# EAGLE design Slave (EAGLE 9.3.0)
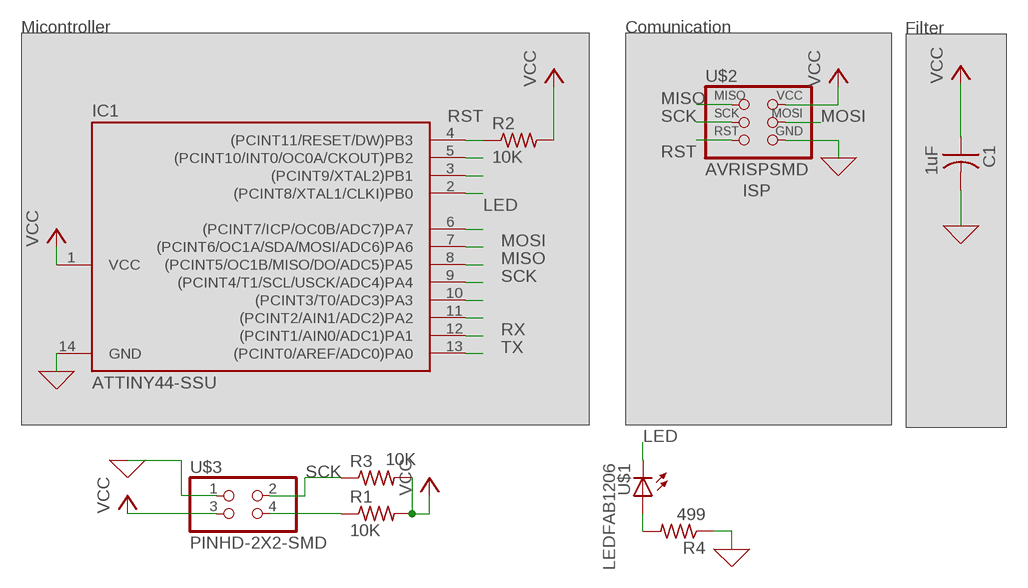
[diagram p0: schematic, sheet 1]

## Parts
C1  1uF  CAP-US1206FAB  [C1206FAB]
IC1  ATTINY44-SSU  [SOIC14]
R1  10K  RES-US1206FAB  [R1206FAB]
R2  10K  RES-US1206FAB  [R1206FAB]
R3  10K  RES-US1206FAB  [R1206FAB]
R4  499  RES-US1206FAB  [R1206FAB]
U$1  LEDFAB1206  [LED1206FAB]
U$2  AVRISPSMD  [2X03SMD]
U$3  PINHD-2X2-SMD  [2X02SMD]

## Nets
0: C1.2 IC1.14(GND) R4.1 U$2.6(GND) U$3.1 ; supply symbol labelled GND
LED: IC1.6((PCINT7/ICP/OC0B/ADC7)PA7) U$1.2(C)
MISO: IC1.8((PCINT5/OC1B/MISO/DO/ADC5)PA5) U$2.1(MISO)
MOSI: IC1.7((PCINT6/OC1A/SDA/MOSI/ADC6)PA6) R1.1 U$2.4(MOSI) U$3.4
N$1: R4.2 U$1.1(A)
N$5: IC1.5((PCINT10/INT0/OC0A/CKOUT)PB2)
N$6: IC1.3((PCINT9/XTAL2)PB1)
N$7: IC1.2((PCINT8/XTAL1/CLKI)PB0)
N$12: IC1.10((PCINT3/T0/ADC3)PA3)
N$13: IC1.11((PCINT2/AIN1/ADC2)PA2)
RST: IC1.4((PCINT11/RESET/DW)PB3) R2.1 U$2.5(RST)
RX: IC1.12((PCINT1/AIN0/ADC1)PA1)
SCK: IC1.9((PCINT4/T1/SCL/USCK/ADC4)PA4) R3.1 U$2.3(SCK) U$3.2
TX: IC1.13((PCINT0/AREF/ADC0)PA0)
VCC: C1.1 IC1.1(VCC) R1.2 R2.2 R3.2 U$2.2(VCC) U$3.3

## Notes on the sheet
- Micontroller | Comunication | Filter
- ISP

## Library data of the parts
C1 = fab:CAP-US
IC1 = fab:ATTINY44
R1-R4 = fab:RES-US: Resistor (US Symbol) Variants with postfix FAB are widened to allow the routing of internal traces
U$1 = fab:LED: LED
U$2 = fab:AVRISP
U$3 = fab:PINHD-2X2-SMD

## Board
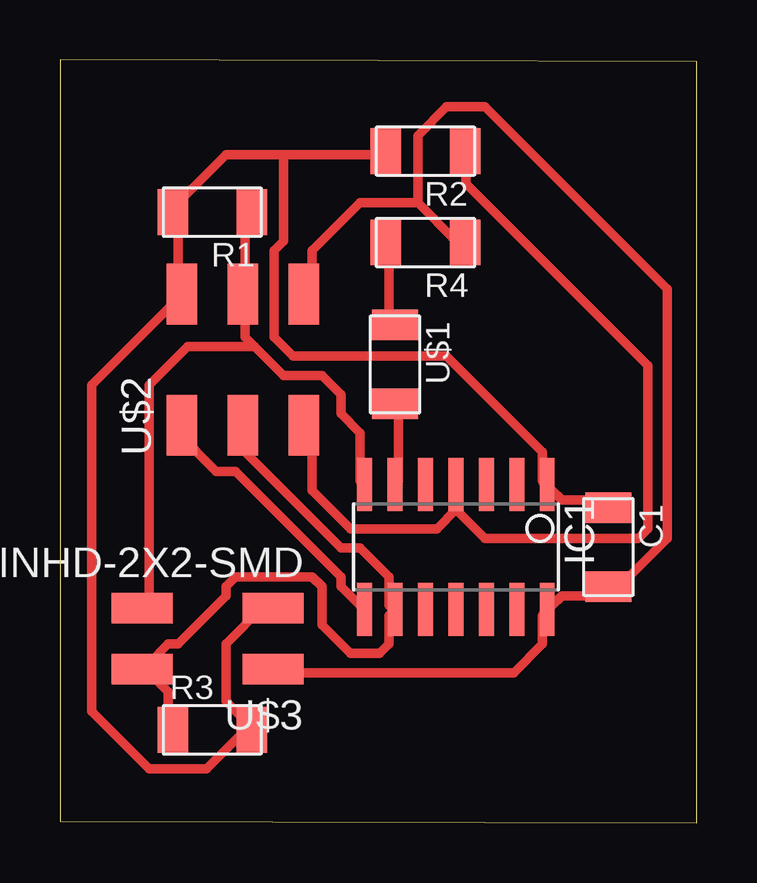
[diagram p1: board, top side]

Size 26.54 x 31.8 mm. Coordinates in mm from the lower left corner, seen from the top.
Outline: 0,0.06 26.54,0 26.54,31.74 0,31.8 0,0.06
Copper layers (1*16): Top 0.035mm / dielectric 1.5mm / Bottom 0.035mm
Design rules "default *": minimum track width 0.4mm, minimum drill 0.35mm, track to track 0.4mm, track to pad 0.4mm, pad to pad 0.4mm, via to via 0.4mm, smd to smd 0.4mm, copper to edge 40mil, drill to drill 6mil, minimum pad ring 10mil, minimum via ring 8mil, stop-mask expansion 4mil, vias tented up to drill 0mil, thermal gap 10mil

### Footprints (pad centres in the part's own frame; a part is rotated, then mirrored left to right if it is on the bottom)
C1206FAB = smd 1.27 x 1.905: 1 -1.651,0; 2 1.651,0
SOIC14 = smd 0.61 x 2.21: 1 -3.81,-2.603; 2 -2.54,-2.603; 3 -1.27,-2.603; 4 0,-2.603; 5 1.27,-2.603; 6 2.54,-2.603; 7 3.81,-2.603; 8 3.81,2.603; 9 2.54,2.603; 10 1.27,2.603; 11 0,2.603; 12 -1.27,2.603; 13 -2.54,2.603; 14 -3.81,2.603
R1206FAB = smd 1.27 x 1.905: 1 -1.651,0; 2 1.651,0
LED1206FAB = smd 1.27 x 1.905: 1 -1.651,0; 2 1.651,0
2X03SMD = smd 2.54 x 1.27: 1 -2.54,2.54; 2 2.92,2.54; 3 -2.54,0; 4 2.92,0; 5 -2.54,-2.54; 6 2.92,-2.54
2X02SMD = smd 2.54 x 1.27: 1 -2.54,1.27; 2 2.92,1.27; 3 -2.54,-1.27; 4 2.92,-1.27

### Placement (x,y rotation side)
C1  22.86,11.49 270 top
IC1  16.51,11.49 180 top
R1  6.35,25.46 180 top
R2  15.24,28 180 top
R3  6.35,3.87 0 top
R4  15.24,24.19 180 top
U$1  13.97,19.11 270 top
U$2  7.62,19.11 90 top
U$3  6.35,7.68 180 top

### Tracks (layer width: path | path; a pad name or v marks a point on that pad's centre or on a via)
0
  Top 0.4: 14.92,25.85 16.52,24.25 R4.1 | 14.92,25.85 12.52,25.85 10.52,23.85 10.52,22.25 U$2.6 | U$3.1 8.92,6.25 18.92,6.25 20.12,7.45 20.12,8.65 IC1.14 20.52,9.05 20.92,9.45 22.52,9.45 C1.2 22.92,9.45 25.32,11.85 25.32,22.25 17.72,29.85 16.12,29.85 14.92,28.65 14.92,25.85
LED
  Top 0.4: U$1.2 14.12,17.45 14.12,14.25 IC1.6
MISO
  Top 0.4: IC1.8 12.52,9.05 11.72,9.85 11.72,10.25 7.32,14.65 6.52,14.65 4.92,16.25 U$2.1
MOSI
  Top 0.4: R1.1 7.72,25.45 7.72,22.25 U$2.4 7.72,21.85 7.72,20.25 8.12,19.85 | 8.12,19.85 9.32,18.65 10.92,18.65 11.72,17.85 11.72,17.05 12.52,16.25 12.52,14.25 IC1.7 | 8.12,19.85 5.32,19.85 3.72,18.25 3.72,9.05 U$3.4
N$1
  Top 0.4: R4.2 13.72,23.85 13.72,21.05 U$1.1
RST
  Top 0.4: 16.52,13.05 17.72,11.85 24.12,11.85 24.52,12.25 24.52,19.05 16.92,26.65 16.92,27.85 R2.1 | 16.52,13.05 16.52,13.85 IC1.4 16.52,13.05 | 16.52,13.05 15.72,12.25 12.12,12.25 10.52,13.85 10.52,16.25 U$2.5
SCK
  Top 0.4: R3.1 4.52,4.25 4.52,5.45 3.72,6.25 U$3.2 3.72,6.65 4.52,7.45 4.92,7.45 6.92,9.45 6.92,9.85 7.32,10.25 10.52,10.25 10.92,9.85 10.92,8.25 12.12,7.05 13.32,7.05 13.72,7.45 13.72,8.65 IC1.9 13.72,9.05 13.72,10.25 12.52,11.45 11.72,11.45 7.72,15.45 7.72,16.25 U$2.3
VCC
  Top 0.4: U$3.3 8.52,9.05 6.92,7.45 6.92,5.05 7.72,4.25 R3.2 7.72,3.85 6.12,2.25 3.72,2.25 1.32,4.65 1.32,18.25 4.92,21.85 U$2.2 4.92,22.25 4.92,25.45 R1.2 4.92,25.85 6.92,27.85 9.32,27.85 | C1.1 22.52,13.45 20.92,13.45 20.52,13.85 IC1.1 20.12,14.25 20.12,15.45 16.12,19.45 9.72,19.45 8.92,20.25 8.92,23.85 9.32,24.25 9.32,27.85 | 9.32,27.85 13.32,27.85 R2.2